# EAGLE design FutureBotNanoShield (EAGLE 9.6.2)
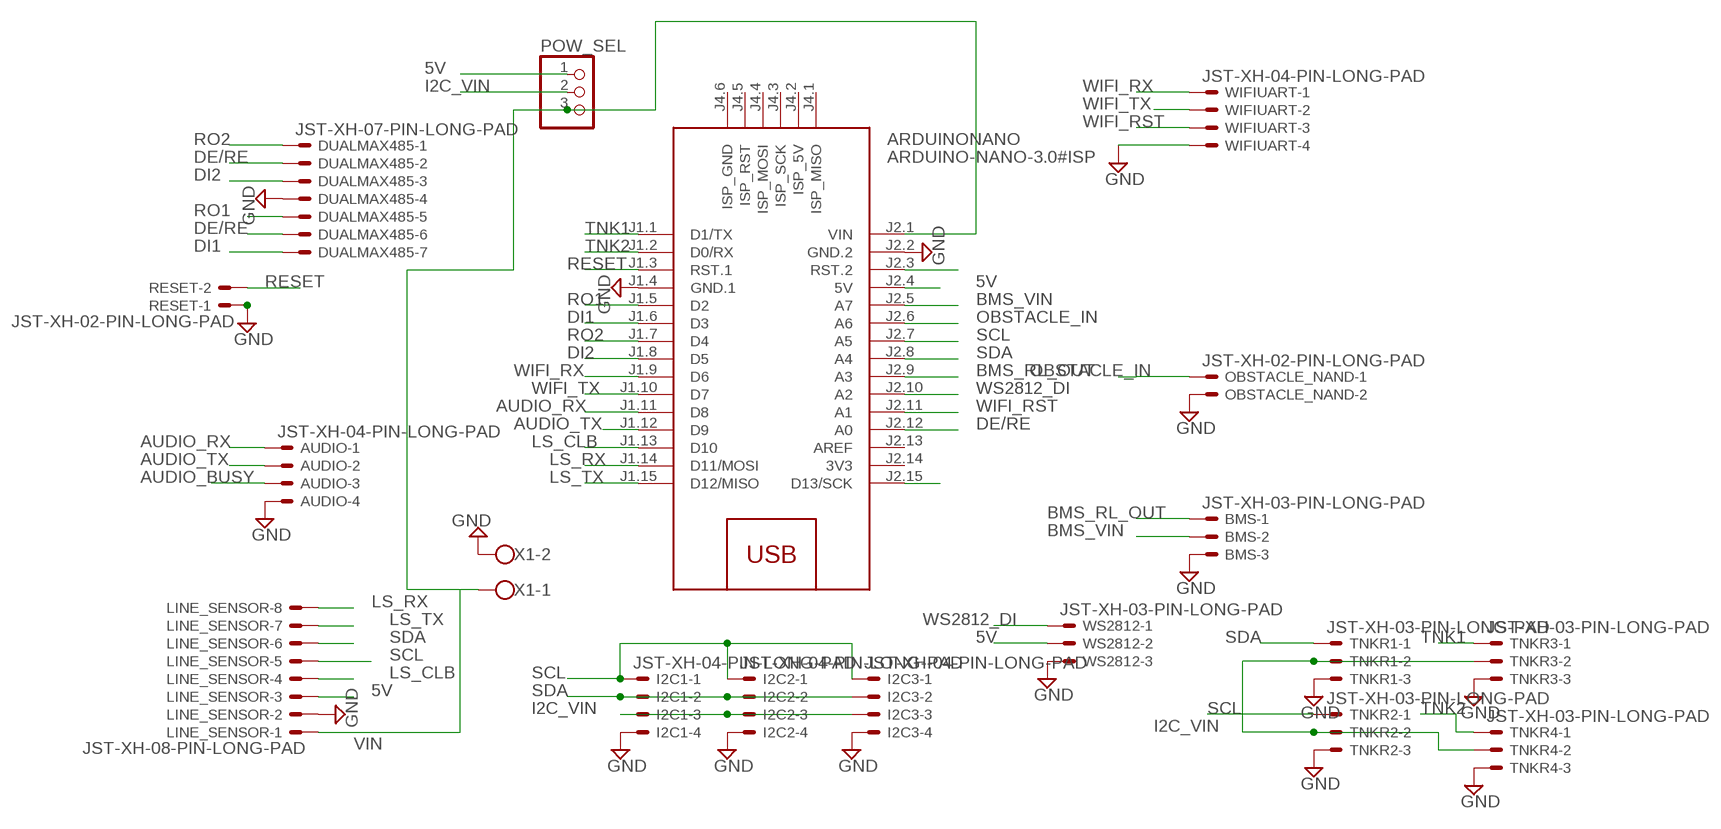
[diagram p0: schematic, sheet 1]

## Parts
ARDUINONANO  ARDUINO-NANO-3.0#ISP  [ARDUINO-NANO-3.0#ISP]
AUDIO  JST-XH-04-PIN-LONG-PAD  [JST-XH-04-PACKAGE-LONG-PAD]
BMS  JST-XH-03-PIN-LONG-PAD  [JST-XH-03-PACKAGE-LONG-PAD]
DUALMAX485  JST-XH-07-PIN-LONG-PAD  [JST-XH-07-PACKAGE-LONG-PAD]
I2C1  JST-XH-04-PIN-LONG-PAD  [JST-XH-04-PACKAGE-LONG-PAD]
I2C2  JST-XH-04-PIN-LONG-PAD  [JST-XH-04-PACKAGE-LONG-PAD]
I2C3  JST-XH-04-PIN-LONG-PAD  [JST-XH-04-PACKAGE-LONG-PAD]
LINE_SENSOR  JST-XH-08-PIN-LONG-PAD  [JST-XH-08-PACKAGE-LONG-PAD]
OBSTACLE_NAND  JST-XH-02-PIN-LONG-PAD  [JST-XH-02-PACKAGE-LONG-PAD]
POW_SEL  PINHD-1X3  [1X03]
RESET  JST-XH-02-PIN-LONG-PAD  [JST-XH-02-PACKAGE-LONG-PAD]
TNKR1  JST-XH-03-PIN-LONG-PAD  [JST-XH-03-PACKAGE-LONG-PAD]
TNKR2  JST-XH-03-PIN-LONG-PAD  [JST-XH-03-PACKAGE-LONG-PAD]
TNKR3  JST-XH-03-PIN-LONG-PAD  [JST-XH-03-PACKAGE-LONG-PAD]
TNKR4  JST-XH-03-PIN-LONG-PAD  [JST-XH-03-PACKAGE-LONG-PAD]
WIFIUART  JST-XH-04-PIN-LONG-PAD  [JST-XH-04-PACKAGE-LONG-PAD]
WS2812  JST-XH-03-PIN-LONG-PAD  [JST-XH-03-PACKAGE-LONG-PAD]
X1  W237-102  [W237-102]

## Nets
5V: ARDUINONANO.J2.4(5V) LINE_SENSOR.3 POW_SEL.1 WS2812.2
AUDIO_BUSY: AUDIO.3
AUDIO_RX: ARDUINONANO.J1.11(D8) AUDIO.1
AUDIO_TX: ARDUINONANO.J1.12(D9) AUDIO.2
BMS_RL_OUT: ARDUINONANO.J2.9(A3) BMS.1
BMS_VIN: ARDUINONANO.J2.5(A7) BMS.2
DE/RE: ARDUINONANO.J2.12(A0) DUALMAX485.2 DUALMAX485.6
DI1: ARDUINONANO.J1.6(D3) DUALMAX485.7
DI2: ARDUINONANO.J1.8(D5) DUALMAX485.3
GND: ARDUINONANO.J1.4(GND.1) ARDUINONANO.J2.2(GND.2) AUDIO.4 BMS.3 DUALMAX485.4 I2C1.4 I2C2.4 I2C3.4 LINE_SENSOR.2 OBSTACLE_NAND.2 RESET.1 TNKR1.3 TNKR2.3 TNKR3.3 TNKR4.3 WIFIUART.4 WS2812.3 X1.2
I2C_VIN: I2C1.3 I2C2.3 I2C3.3 POW_SEL.2 TNKR1.2 TNKR2.2 TNKR3.2 TNKR4.2
LS_CLB: ARDUINONANO.J1.13(D10) LINE_SENSOR.4
LS_RX: ARDUINONANO.J1.14(D11/MOSI) LINE_SENSOR.8
LS_TX: ARDUINONANO.J1.15(D12/MISO) LINE_SENSOR.7
N$12: ARDUINONANO.J2.15(D13/SCK)
N$22: ARDUINONANO.J2.3(RST.2)
OBSTACLE_IN: ARDUINONANO.J2.6(A6) OBSTACLE_NAND.1
RESET: ARDUINONANO.J1.3(RST.1) RESET.2
RO1: ARDUINONANO.J1.5(D2) DUALMAX485.5
RO2: ARDUINONANO.J1.7(D4) DUALMAX485.1
SCL: ARDUINONANO.J2.7(A5) I2C1.1 I2C2.1 I2C3.1 LINE_SENSOR.5 TNKR2.1
SDA: ARDUINONANO.J2.8(A4) I2C1.2 I2C2.2 I2C3.2 LINE_SENSOR.6 TNKR1.1
TNK1: ARDUINONANO.J1.1(D1/TX) TNKR3.1
TNK2: ARDUINONANO.J1.2(D0/RX) TNKR4.1
VIN: ARDUINONANO.J2.1(VIN) LINE_SENSOR.1 POW_SEL.3 X1.1
WIFI_RST: ARDUINONANO.J2.11(A1) WIFIUART.3
WIFI_RX: ARDUINONANO.J1.9(D6) WIFIUART.1
WIFI_TX: ARDUINONANO.J1.10(D7) WIFIUART.2
WS2812_DI: ARDUINONANO.J2.10(A2) WS2812.1
Unconnected: ARDUINONANO.J2.13(AREF) ARDUINONANO.J4.1(ISP_MISO) ARDUINONANO.J4.2(ISP_5V) ARDUINONANO.J4.3(ISP_SCK) ARDUINONANO.J4.4(ISP_MOSI) ARDUINONANO.J4.5(ISP_RST) ARDUINONANO.J4.6(ISP_GND)

## Power pins joined to a net without a drawn wire
3V3: ARDUINONANO.J2.14(3V3)

## Library data of the parts
ARDUINONANO = diy-modules:ARDUINO-NANO-3.0#ISP: Arduino Nano 3.0 (and compatible devices) with ISP pads More details available here: https://www.arduino.cc/en/Main/ArduinoBoardNano Click here to find device on ebay.com <http://www.ebay.com/sch/arduino+nano>
AUDIO I2C1-I2C3 WIFIUART = Rembrandt Electronics - JST XH Connectors v1-0:JST-XH-04-PIN: JST XH Connector 2 Pin Wire to board connector. Pitch: 2,54 mm, (0.100") Number of pins: 4 Created by Rembrandt Electronics www.rembrandtelectronics.com
BMS TNKR1-TNKR4 WS2812 = Rembrandt Electronics - JST XH Connectors v1-0:JST-XH-03-PIN: JST XH Connector 2 Pin Wire to board connector. Pitch: 2,54 mm, (0.100") Number of pins: 3 Created by Rembrandt Electronics www.rembrandtelectronics.com
DUALMAX485 = Rembrandt Electronics - JST XH Connectors v1-0:JST-XH-07-PIN: JST XH Connector 2 Pin Wire to board connector. Pitch: 2,54 mm, (0.100") Number of pins: 7 Created by Rembrandt Electronics www.rembrandtelectronics.com
LINE_SENSOR = Rembrandt Electronics - JST XH Connectors v1-0:JST-XH-08-PIN: JST XH Connector 2 Pin Wire to board connector. Pitch: 2,54 mm, (0.100") Number of pins: 8 Created by Rembrandt Electronics www.rembrandtelectronics.com
OBSTACLE_NAND RESET = Rembrandt Electronics - JST XH Connectors v1-0:JST-XH-02-PIN: JST XH Connector 2 Pin Wire to board connector. Pitch: 2,54 mm, (0.100") Number of pins: 2 Created by Rembrandt Electronics www.rembrandtelectronics.com
POW_SEL = adafruit:PINHD-1X3: PIN HEADER
X1 = con-wago-500:W237-102: WAGO SCREW CLAMP; MPN: 237-102; OC_FARNELL: unknown; OC_NEWARK: 70K9898

## Board
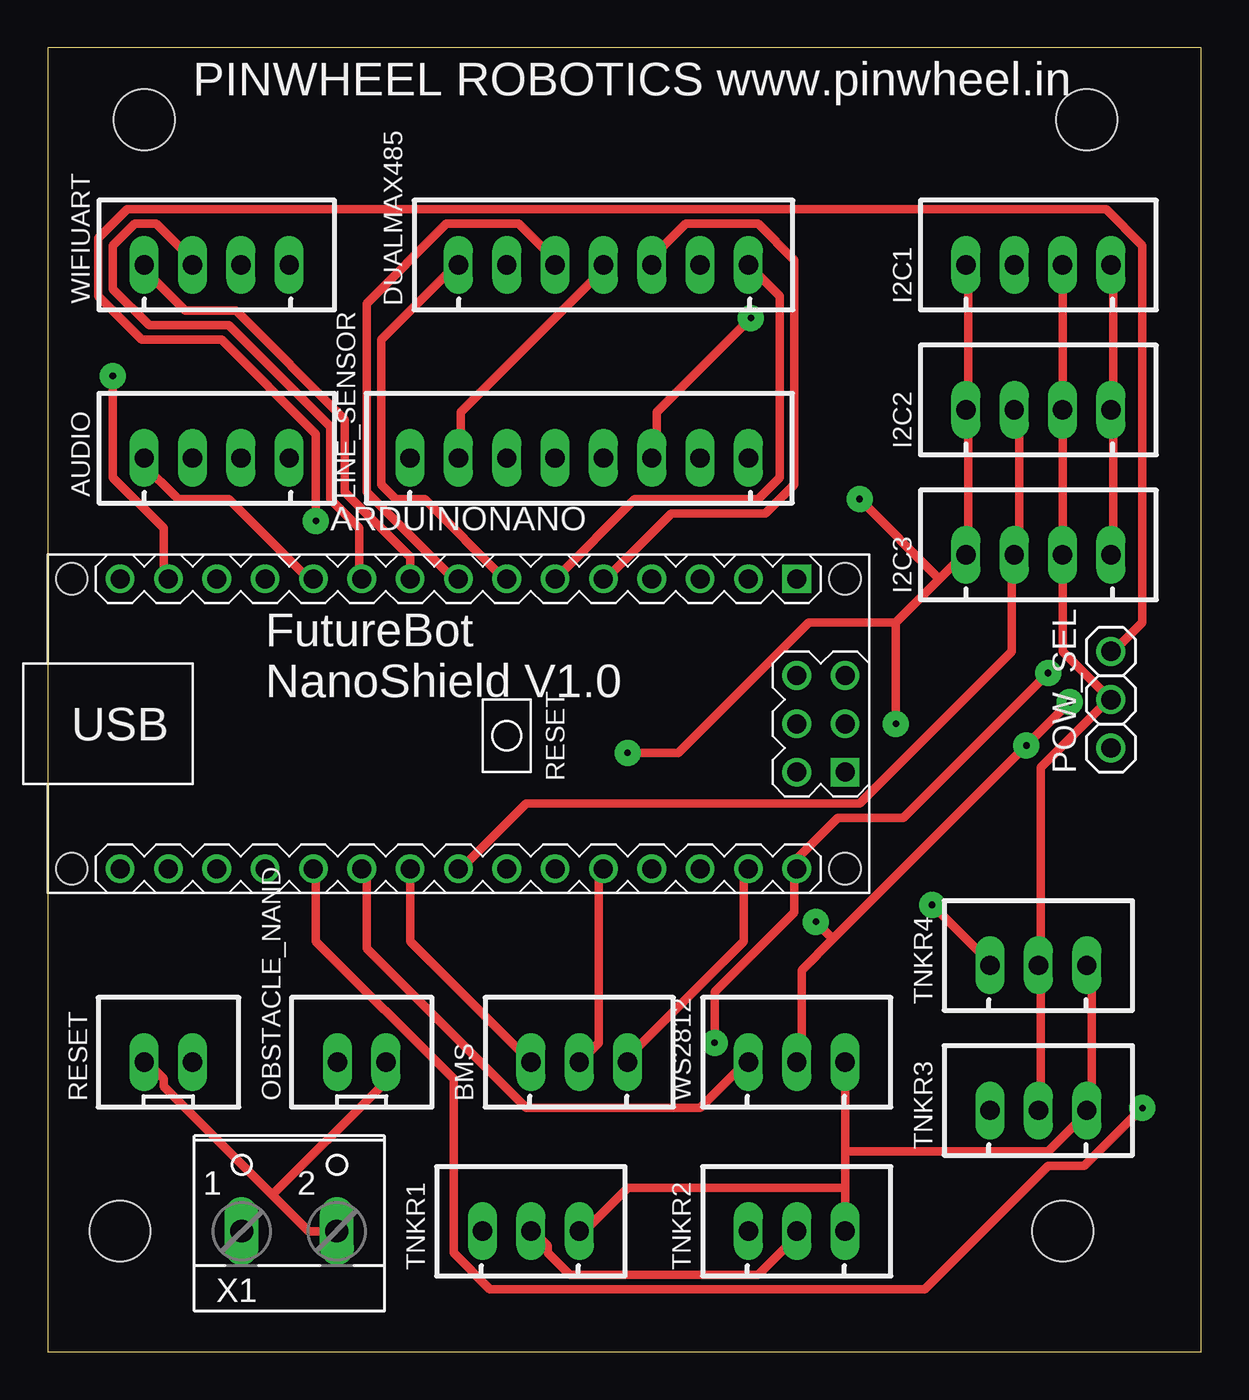
[diagram p1: board, top side]
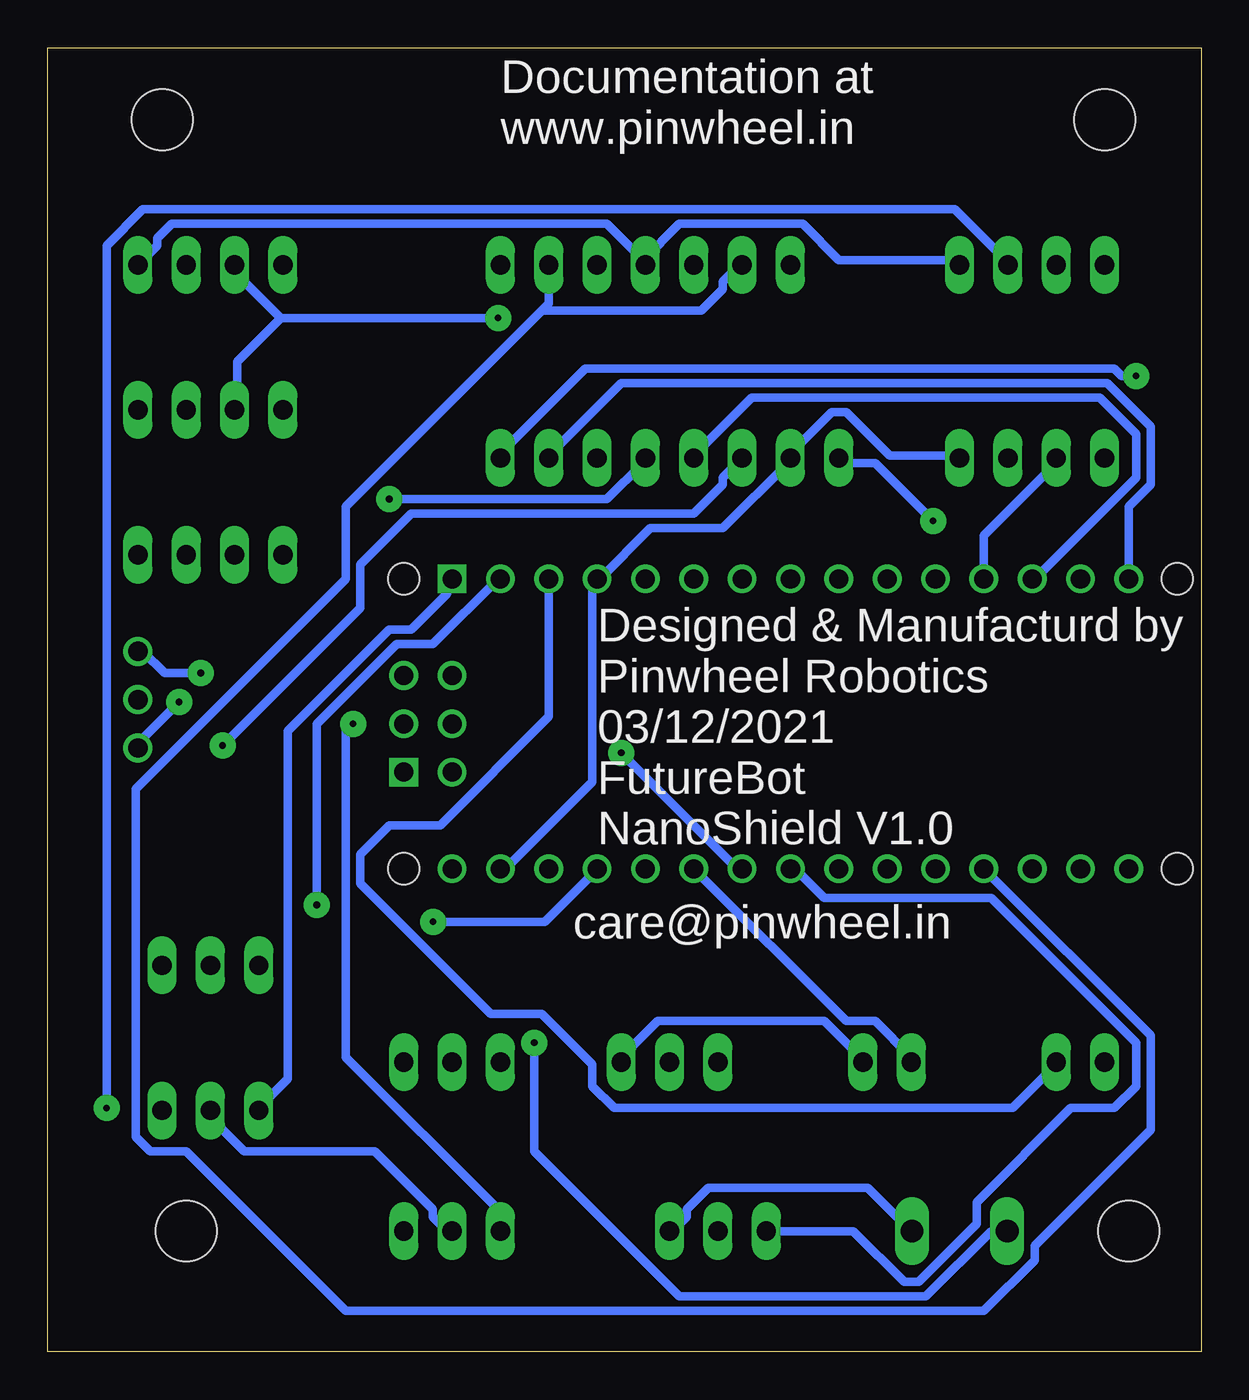
[diagram p2: board, bottom side, seen from below]

Size 60.63 x 68.57 mm. Coordinates in mm from the lower left corner, seen from the top.
Outline: 0,0 60.63,0 60.63,68.57 0,68.57 0,0
Copper layers (1*16): Top 0.035mm / dielectric 1.5mm / Bottom 0.035mm
Design rules "default *": minimum track width 18mil, minimum drill 0.35mm, track to track 12mil, track to pad 12mil, pad to pad 12mil, via to via 12mil, smd to smd 6mil, copper to edge 40mil, drill to drill 12mil, minimum pad ring 10mil, minimum via ring 20mil, stop-mask expansion 4mil, vias tented up to drill 0mil, thermal gap 10mil
Holes 3.2 mm at 5.08,64.77 54.61,64.77 53.34,6.35 3.81,6.35

### Footprints (pad centres in the part's own frame; a part is rotated, then mirrored left to right if it is on the bottom)
ARDUINO-NANO-3.0#ISP = drill 1 square: J1.1 17.78,7.62; J4.1 20.32,-2.54 | drill 1: J1.2 15.24,7.62; J1.3 12.7,7.62; J1.4 10.16,7.62; J1.5 7.62,7.62; J1.6 5.08,7.62; J1.7 2.54,7.62; J1.8 0,7.62; J1.9 -2.54,7.62; J1.10 -5.08,7.62; J1.11 -7.62,7.62; J1.12 -10.16,7.62; J1.13 -12.7,7.62; J1.14 -15.24,7.62; J1.15 -17.78,7.62; J2.1 17.78,-7.62; J2.2 15.24,-7.62; J2.3 12.7,-7.62; J2.4 10.16,-7.62; J2.5 7.62,-7.62; J2.6 5.08,-7.62; J2.7 2.54,-7.62; J2.8 0,-7.62; J2.9 -2.54,-7.62; J2.10 -5.08,-7.62; J2.11 -7.62,-7.62; J2.12 -10.16,-7.62; J2.13 -12.7,-7.62; J2.14 -15.24,-7.62; J2.15 -17.78,-7.62; J4.2 17.78,-2.54; J4.3 20.32,0; J4.4 17.78,0; J4.5 20.32,2.54; J4.6 17.78,2.54 | hole 1.651: -20.32,7.62; -20.32,-7.62; 20.32,-7.62; 20.32,7.62
JST-XH-04-PACKAGE-LONG-PAD = drill 1.016 long: 1 -3.81,0; 2 -1.27,0; 3 1.27,0; 4 3.81,0
JST-XH-03-PACKAGE-LONG-PAD = drill 1.016 long: 1 -2.54,0; 2 0,0; 3 2.54,0
JST-XH-07-PACKAGE-LONG-PAD = drill 1.016 long: 1 -7.62,0; 2 -5.08,0; 3 -2.54,0; 4 0,0; 5 2.54,0; 6 5.08,0; 7 7.62,0
JST-XH-08-PACKAGE-LONG-PAD = drill 1.016 long: 1 -8.89,0; 2 -6.35,0; 3 -3.81,0; 4 -1.27,0; 5 1.27,0; 6 3.81,0; 7 6.35,0; 8 8.89,0
JST-XH-02-PACKAGE-LONG-PAD = drill 1.016 long: 1 -1.27,0; 2 1.27,0
1X03 = drill 1.016: 1 -2.54,0; 2 0,0; 3 2.54,0
W237-102 = drill 1.194 long: 1 -2.5,-1.27; 2 2.5,-1.27

### Placement (x,y rotation side)
ARDUINONANO  21.59,33.02 0 top
AUDIO  8.89,46.99 0 top
BMS  27.94,15.24 0 top
DUALMAX485  29.21,57.15 0 top
I2C1  52.07,57.15 0 top
I2C2  52.07,49.53 0 top
I2C3  52.07,41.91 0 top
LINE_SENSOR  27.94,46.99 0 top
OBSTACLE_NAND  16.51,15.24 0 top
POW_SEL  55.88,34.29 90 top
RESET  6.35,15.24 0 top
TNKR1  25.4,6.35 0 top
TNKR2  39.37,6.35 0 top
TNKR3  52.07,12.7 0 top
TNKR4  52.07,20.32 0 top
WIFIUART  8.89,57.15 0 top
WS2812  39.37,15.24 0 top
X1  12.7,7.62 0 top

### Tracks (layer width: path | path; a pad name or v marks a point on that pad's centre or on a via)
5V  (via drill 0.35)
  Top 0.457: v53.72,34.16 v51.44,31.88 41.27,21.71 | 41.27,21.71 39.62,20.07 39.62,15.49 WS2812.2 | 41.27,21.71 v40.38,22.61
  Bottom 0.457: v53.72,34.16 56.01,31.88 POW_SEL.1 | LINE_SENSOR.3 25.15,45.97 25.15,45.59 26.67,44.07 41.53,44.07 44.2,41.4 44.2,39.12 v51.44,31.88 | v40.38,22.61 34.5,22.61 31.75,25.36 ARDUINONANO.J2.4
AUDIO_RX
  Top 0.457: ARDUINONANO.J1.11 13.72,40.64 9.53,44.83 6.86,44.83 4.95,46.74 AUDIO.1
AUDIO_TX
  Bottom 0.457: ARDUINONANO.J1.12 11.43,42.93 7.62,46.74 AUDIO.2
BMS_RL_OUT
  Top 0.457: ARDUINONANO.J2.9 19.05,21.59 BMS.1
BMS_VIN
  Top 0.457: BMS.2 28.96,16.26 28.96,25.4 ARDUINONANO.J2.5
DE/RE
  Bottom 0.457: ARDUINONANO.J2.12 2.67,16.64 2.67,11.68 8.76,5.59 8.76,4.83 11.43,2.16 44.96,2.16 53.34,10.54 55.24,10.54 56.01,11.3 56.01,29.59 44.96,40.64 44.96,44.45 34.67,54.74 | 34.67,54.74 34.29,55.12 DUALMAX485.6 | 34.67,54.74 26.29,54.74 25.15,55.88 25.15,56.26 24.38,57.02 DUALMAX485.2
DI1
  Top 0.457: ARDUINONANO.J1.6 30.86,44.83 37.34,44.83 38.48,45.97 38.48,55.5 DUALMAX485.7
DI2
  Top 0.457: ARDUINONANO.J1.8 21.34,40.64 16.76,45.21 16.76,55.12 20.95,59.31 24.77,59.31 26.67,57.4 DUALMAX485.3
GND
  Top 0.457: I2C3.4 56.01,42.16 56.01,49.4 I2C2.4 56.01,49.78 56.01,57.02 I2C1.4 | LINE_SENSOR.2 21.72,47.12 21.72,49.4 29.34,57.02 DUALMAX485.4 | TNKR4.3 54.86,20.07 54.86,12.83 TNKR3.3 54.48,12.45 52.58,10.54 41.91,10.54 | WS2812.3 41.91,10.54 | 41.91,10.54 41.91,8.64 | 41.91,8.64 TNKR2.3 | ARDUINONANO.J2.2 36.58,25.4 36.58,21.59 30.48,15.49 BMS.3 | 11.81,8.25 13.72,6.35 X1.2 | 11.81,8.25 6.1,13.97 6.1,14.35 5.33,15.11 RESET.1 | 11.81,8.25 17.53,13.97 17.53,15.11 OBSTACLE_NAND.2 | 41.91,8.64 30.48,8.64 28.19,6.35 TNKR1.3
  Bottom 0.457: AUDIO.4 12.95,47.12 16.38,47.12 18.67,49.4 19.43,49.4 21.72,47.12 LINE_SENSOR.2 21.72,46.74 25.15,43.31 28.96,43.31 31.62,40.64 ARDUINONANO.J1.4 32,40.64 32,29.97 36.58,25.4 ARDUINONANO.J2.2 | 29.34,57.4 27.43,59.31 20.95,59.31 19.05,57.4 12.95,57.4 WIFIUART.4 | I2C1.4 54.86,58.17 54.86,58.55 54.1,59.31 31.24,59.31 29.34,57.4 | 29.34,57.4 DUALMAX485.4 | TNKR1.3 27.81,6.35 27.05,7.11 27.05,7.49 25.91,8.64 17.53,8.64 15.24,6.35 X1.2 | BMS.3 30.48,15.49 28.57,17.4 19.81,17.4 17.91,15.49 OBSTACLE_NAND.2
I2C_VIN
  Top 0.457: TNKR1.2 25.53,6.35 26.29,5.59 26.29,5.21 27.43,4.06 37.34,4.06 39.62,6.35 TNKR2.2 | TNKR3.2 52.2,12.83 52.2,20.07 TNKR4.2 52.2,20.45 52.2,30.73 55.63,34.16 POW_SEL.2 53.34,36.83 I2C3.3 I2C2.3 I2C1.3
  Bottom 0.457: TNKR2.2 39.62,6.35 40.39,7.11 40.39,7.49 43.43,10.54 50.29,10.54 52.2,12.45 TNKR3.2
LS_CLB
  Bottom 0.457: ARDUINONANO.J1.13 8.76,40.64 3.43,45.97 3.43,48.26 5.33,50.16 23.62,50.16 26.67,47.12 LINE_SENSOR.4
LS_RX  (via drill 0.35)
  Top 0.457: v3.43,51.31 3.43,45.97 6.1,43.31 6.1,40.64 ARDUINONANO.J1.14
  Bottom 0.457: v3.43,51.31 4.19,51.31 4.57,51.69 32.38,51.69 36.96,47.12 LINE_SENSOR.8
LS_TX
  Bottom 0.457: ARDUINONANO.J1.15 3.81,44.45 2.67,45.59 2.67,48.64 4.95,50.93 30.48,50.93 34.29,47.12 LINE_SENSOR.7
OBSTACLE_IN
  Bottom 0.457: ARDUINONANO.J2.6 18.67,17.4 17.14,17.4 15.24,15.49 OBSTACLE_NAND.1
RESET
  Bottom 0.457: ARDUINONANO.J1.3 34.29,33.4 40.01,27.69 42.67,27.69 44.2,26.16 44.2,24.64 37.34,17.78 34.67,17.78 32,15.11 32,13.97 30.86,12.83 9.91,12.83 7.62,15.11 RESET.2
RO1
  Top 0.457: ARDUINONANO.J1.5 29.34,40.64 32.77,44.07 37.72,44.07 39.24,45.59 39.24,57.4 37.34,59.31 33.53,59.31 31.62,57.4 DUALMAX485.5
RO2
  Top 0.457: ARDUINONANO.J1.7 24,40.64 19.81,44.83 18.29,44.83 17.53,45.59 17.53,53.21 21.34,57.02 DUALMAX485.1
SCL  (via drill 0.35)
  Top 0.457: v30.48,31.5 33.15,31.5 40.01,38.35 44.58,38.35 | 46.86,40.64 48.01,41.78 I2C3.1 48.39,42.16 48.39,49.4 I2C2.1 48.39,49.78 48.39,57.02 I2C1.1 | 46.86,40.64 44.58,38.35 | 46.86,40.64 v42.67,44.83 | 44.58,38.35 v44.58,33.02
  Bottom 0.457: v30.48,31.5 24.38,25.4 ARDUINONANO.J2.7 | v42.67,44.83 31.24,44.83 29.34,46.74 LINE_SENSOR.5 | v44.58,33.02 44.96,32.64 44.96,15.49 36.96,7.49 36.96,6.35 TNKR2.1
SDA  (via drill 0.35)
  Top 0.457: v36.96,54.36 32,49.4 32,47.12 LINE_SENSOR.6 | ARDUINONANO.J2.8 21.72,25.4 25.15,28.83 42.67,28.83 50.67,36.83 50.67,41.78 I2C3.2 51.05,42.16 51.05,49.4 I2C2.2
  Bottom 0.457: 48.39,54.36 v36.96,54.36 | 48.39,54.36 51.05,57.02 I2C1.2 | 48.39,54.36 50.67,52.07 50.67,49.78 I2C2.2 | TNKR1.1 18.29,6.35 15.62,3.68 14.86,3.68 11.81,6.73 11.81,7.87 6.86,12.83 4.57,12.83 3.43,13.97 3.43,16.26 11.05,23.88 19.81,23.88 21.34,25.4 ARDUINONANO.J2.8
TNK1
  Bottom 0.457: TNKR3.1 49.53,12.83 48.01,14.35 48.01,32.64 42.67,37.97 41.53,37.97 39.62,39.88 39.62,40.64 39.5,40.73 39.38,40.73 ARDUINONANO.J1.1
TNK2  (via drill 0.35)
  Top 0.457: v46.48,23.49 49.53,20.45 TNKR4.1
  Bottom 0.457: v46.48,23.49 46.48,33.02 42.29,37.21 40.39,37.21 36.96,40.64 36.88,40.73 ARDUINONANO.J1.2
VIN  (via drill 0.35)
  Top 0.457: v52.58,35.69 44.96,28.07 41.53,28.07 39.37,25.91 ARDUINONANO.J2.1 39.24,25.4 39.24,23.11 35.05,18.92 v35.05,16.26 | v14.1,43.69 14.1,48.26 9.14,53.21 4.95,53.21 2.67,55.5 2.67,58.55 4.19,60.07 55.63,60.07 57.53,58.17 57.53,38.35 56.01,36.83 POW_SEL.3
  Bottom 0.457: v52.58,35.69 54.48,35.69 55.63,36.83 POW_SEL.3 | v14.1,43.69 17.14,46.74 19.05,46.74 LINE_SENSOR.1 | X1.1 11.05,6.35 14.48,2.92 27.43,2.92 35.05,10.54 v35.05,16.26
WIFI_RST  (via drill 0.35)
  Top 0.457: v57.53,12.83 54.48,9.78 52.58,9.78 46.1,3.3 23.24,3.3 21.34,5.21 21.34,14.35 14.1,21.59 14.1,25.4 ARDUINONANO.J2.11
  Bottom 0.457: v57.53,12.83 57.53,58.17 55.63,60.07 12.95,60.07 10.29,57.4 WIFIUART.3
WIFI_RX
  Top 0.457: ARDUINONANO.J1.9 19.05,41.78 15.62,45.21 15.62,49.02 9.91,54.74 7.24,54.74 4.95,57.02 WIFIUART.1
WIFI_TX
  Top 0.457: ARDUINONANO.J1.10 16.38,40.64 16.38,43.31 14.86,44.83 14.86,48.64 9.53,53.98 5.33,53.98 3.43,55.88 3.43,58.17 4.57,59.31 5.71,59.31 7.62,57.4 WIFIUART.2
WS2812_DI
  Top 0.457: ARDUINONANO.J2.10 16.76,25.4 16.76,21.21 25.15,12.83 34.29,12.83 36.58,15.11 WS2812.1

### Text on the board
tNames: PINWHEEL ROBOTICS www.pinwheel.in | FutureBot / NanoShield V1.0
bNames: Documentation at / www.pinwheel.in | Designed & Manufacturd by / Pinwheel Robotics / 03/12/2021 / FutureBot / NanoShield V1.0 | care@pinwheel.in